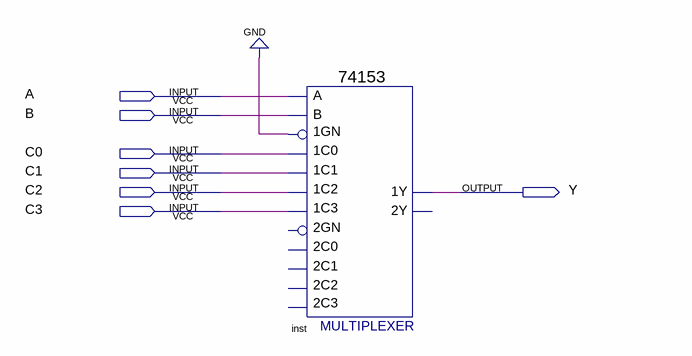
[diagram p0: schematic sheet]
// Quartus schematic pj403.bdf as structural Verilog: 1 symbols, 7 pins
module pj403 (
  input  A,
  input  B,
  input  C0,
  input  C1,
  input  C2,
  input  C3,
  output Y
);

  \74153  inst (
    .\1C1 (C1), .\1GN (1'b0), .\1C0 (C0), .\1C2 (C2), .\1C3 (C3), .B(B), .A(A), .\1Y (Y));  // open: 2C0, 2GN, 2C2, 2C1, 2C3, 2Y
endmodule
